# Altium schematic sheet 6_FPGA_Flash.SchDoc
size A4; SheetNumber: 7; SheetTotal: 13
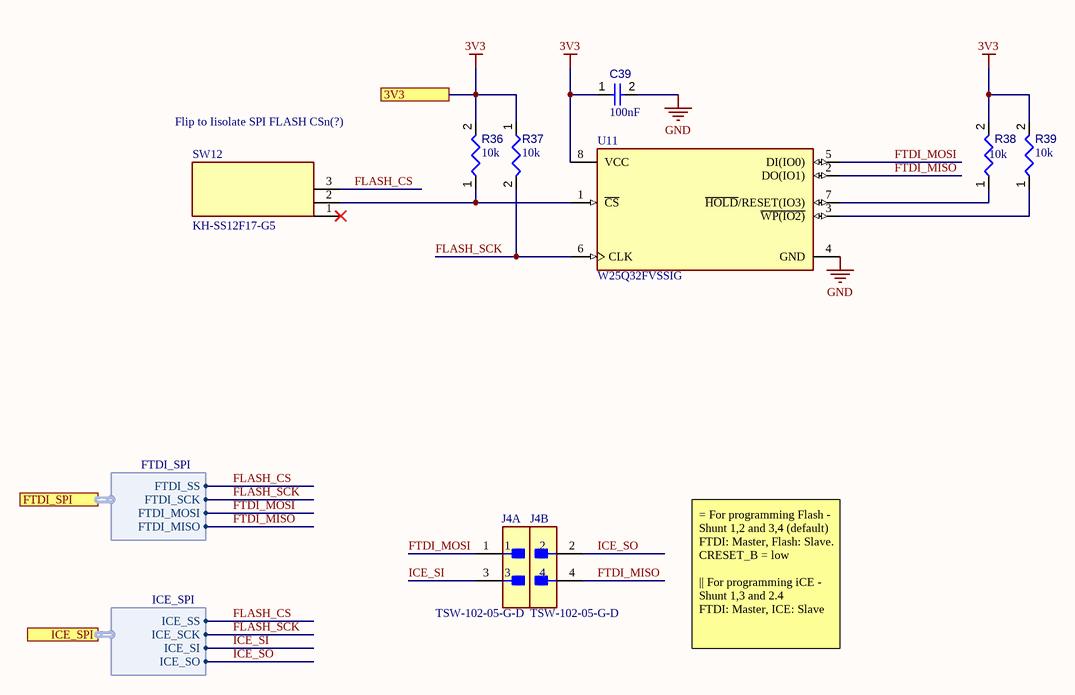
[diagram p0: 6_FPGA_Flash.SchDoc]

## Parts
C39  value 100nF  [CAPC1608X90X40NL10T20]  (hidden comment: Capacitor 100 nF +/-10% 50 V 0603)
J4  TSW-102-05-G-D  [FP-TSW-102-05-G-D-MFG]  (parts A,B of 2)
R36  value 10k  [RESC1608X55X25ML10T15]  (hidden comment: Resistor 10k +/-1% 0603 100 mW)
R37  value 10k  [RESC1608X55X25ML10T15]  (hidden comment: Resistor 10k +/-1% 0603 100 mW)
R38  value 10k  [RESC1608X55X25ML10T15]  (hidden comment: Resistor 10k +/-1% 0603 100 mW)
R39  value 10k  [RESC1608X55X25ML10T15]  (hidden comment: Resistor 10k +/-1% 0603 100 mW)
SW12  KH-SS12F17-G5  [SW-TH_KH-SS12F17-G5]
U11  W25Q32FVSSIG  [FP-SS-MFG]

## Ports
3V3, FTDI_SPI (harness FTDI_SPI), ICE_SPI (harness ICE_SPI)

## Harnesses
FTDI_SPI: FTDI_SS, FTDI_MOSI, FTDI_SCK, FTDI_MISO
ICE_SPI: ICE_SO, ICE_SI, ICE_SCK, ICE_SS

## Nets
3V3: C39.1 R36.2 R37.1 R38.2 R39.2 U11.8(VCC) ; port 3V3
GND: C39.2 U11.4(GND)
FLASH_CS: SW12.3 ; port FTDI_SPI.FTDI_SS, port ICE_SPI.ICE_SS
FLASH_SCK: R37.2 U11.6(CLK) ; port FTDI_SPI.FTDI_SCK, port ICE_SPI.ICE_SCK
FTDI_MISO: J4.4 U11.2(DO(IO1)) ; port FTDI_SPI.FTDI_MISO
FTDI_MOSI: J4.1 U11.5(DI(IO0)) ; port FTDI_SPI.FTDI_MOSI
ICE_SI: J4.3 ; port ICE_SPI.ICE_SI
ICE_SO: J4.2 ; port ICE_SPI.ICE_SO
NetR36_1: R36.1 SW12.2 U11.1(~{CS})
NetR38_1: R38.1 U11.7(~{HOLD}/RESET(IO3))
NetR39_1: R39.1 U11.3(~{WP(IO2)})

Not connected (* = marked no-connect by the designer): SW12 1*

## Notes on the sheet
- Flip to Iisolate SPI FLASH CSn(?)
- Date:
- A4
- Project:
- Time:
- Sheet
- of
- Revision:
- File:
- Drawn By:

## Library data of the parts
C39 = CMP-001-00017-6: Chip Capacitor, 100 nF, +/- 10%, 50 V, 0603 (1608 Metric); Voltage Rating: 50V; Capacitor Type: Ceramic; Tolerance: 10%; Mounting Technology: SM; Max Operating Temperature: 125°C; RoHS Compliant: True; Pins: 2; Case/Package: 0603; Min Operating Temperature: -55°C
J4 = CMP-02766-001389-1: CONN HEADER VERT 4POS 2.54MM; Max Voltage Rating (AC): 550V; Connector Type: Male Pin; Row Spacing: 0.1inch; Max Current Rating: 7.6A; Number of Positions: 4; Gender: Male; Packaging: Bulk; Color: Black; Housing Material: Plastic; Contact Material: Bronze; Contact Plating: Gold; Housing Color: Black; Width: 5.08mm; Orientation: Straight; Pitch: 2.54mm; Lead Free: Lead Free; Series: TSW; Min Operating Temperature: -55°C; Contact Type: Male Pin; Height: 2.54mm; Termination: Solder; Number of Rows: 2; Contact Mating Length: 0.105inch; Package Quantity: 1; Length: 5.08mm; REACH SVHC: No SVHC; Mount: Through Hole; Radiation Hardening: No; Number of Contacts: 4; Max Operating Temperature: 125°C
R36-R39 = CMP-009-00017-5: Chip Resistor, 10 KOhm, +/- 1%, 01 W, -55 to 155 degC, 0603 (1608 Metric); Voltage Rating: 50V; Power: 100mW; RoHS Compliant: True; Min Operating Temperature: -55°C; Pins: 2; Case/Package: 0603; Mounting Technology: SM; Max Operating Temperature: 155°C; Tolerance: 1%
SW12 = KH-SS12F17-G5: Manufacturer: kinghelm(金航标); LCSC Part Name: 拨动开关 KH-SS12F17-G5; Supplier Part: C5274464; Manufacturer Part: KH-SS12F17-G5; Supplier Footprint: 插件; JLCPCB Part Class: Extended Part; Datasheet: https://atta.szlcsc.com/upload/public/pdf/source/20221118/A394A3D39A10FBA52FA26B90A9AAE8C2.pdf; Supplier: LCSC
U11 = CMP-2000-05006-2: IC FLASH 32M SPI 104MHZ 8SOIC; Manufacturer: Winbond; Obsolete Part: true; Access Time: 7ns; Nominal Supply Current: 8-20mA; Memory Size: 32Mbits; Max Supply Voltage: 3.6V; Min Supply Voltage: 2.7V; Standoff Height: 0.05mm; Interface: SPI,Other; Package: SS; Memory Type: FLASH; Ipc Land Pattern Name: SOIC127P790X195-8; Temperature Range High: +85°C; Temperature: -40°C to +85°C; Octopart: https://octopart.com/w25q32fvssig-winbond-23896462; Manufacturer Part Number: W25Q32FVSSIG; Ambient Temperature Range Low: -40°C; Lead Free: Yes; Height: 2.16mm; Automotive: No; Device Class L2: Memory; Digikey Description: IC FLASH 32M SPI 104MHZ 8SOIC; RoHS: TRUE; Frequency: 104MHz; Ambient Temperature Range High: +85°C; ComponentLink2Description: Datasheet; Category: IC; Device Class L1: Integrated Circuits (ICs); Device Class L3: Flash; Temperature Range Low: -40°C; Footprint Url: http://www.winbond.com/resource-files/an0000009%20spiflash%20pcb%20layout%20guideline%20v2.0%2009252017.pdf?__locale=en; ComponentLink2URL: https://www.winbond.com/resource-files/w25q32fv%20revj%2006032016.pdf